# Altium schematic sheet Sheet1.SchDoc
size A4; SheetNumber: 1; SheetTotal: 1; SPICEModelCacheJLRNBVED: <root> / <DocumentId>JLRNBVED</DocumentId> / </root>
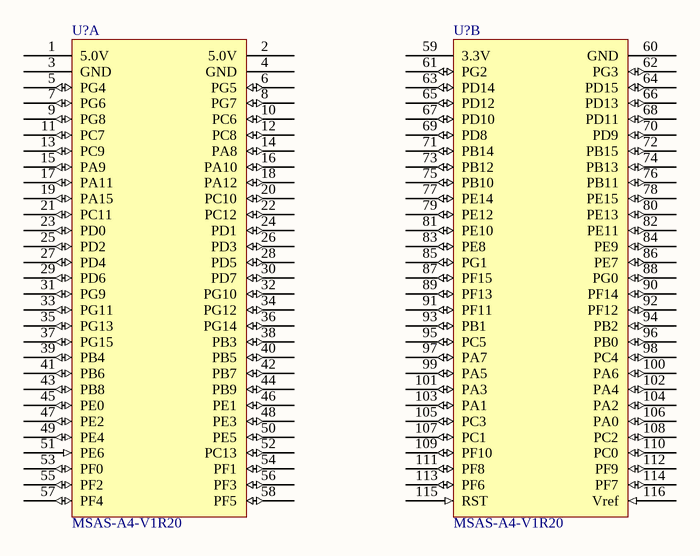
[diagram p0: Sheet1.SchDoc]

## Parts
(Parts that share a designator on the sheet are numbered #1, #2 ... from top to bottom, then left to right.)
U?#1  MSAS-A4-V1R20  [MSAS-A4-PCBLIB-V1R20]  (part A of 2)
U?#2  MSAS-A4-V1R20  [MSAS-A4-PCBLIB-V1R20]  (part B of 2)

## Nets

Not connected (* = marked no-connect by the designer): U?#1 1(5.0V) 2(5.0V) 3(GND) 4(GND) 5(PG4) 6(PG5) 7(PG6) 8(PG7) 9(PG8) 10(PC6) 11(PC7) 12(PC8) 13(PC9) 14(PA8) 15(PA9) 16(PA10) 17(PA11) 18(PA12) 19(PA15) 20(PC10) 21(PC11) 22(PC12) 23(PD0) 24(PD1) 25(PD2) 26(PD3) 27(PD4) 28(PD5) 29(PD6) 30(PD7) 31(PG9) 32(PG10) 33(PG11) 34(PG12) 35(PG13) 36(PG14) 37(PG15) 38(PB3) 39(PB4) 40(PB5) 41(PB6) 42(PB7) 43(PB8) 44(PB9) 45(PE0) 46(PE1) 47(PE2) 48(PE3) 49(PE4) 50(PE5) 51(PE6) 52(PC13) 53(PF0) 54(PF1) 55(PF2) 56(PF3) 57(PF4) 58(PF5); U?#2 59(3.3V) 60(GND) 61(PG2) 62(PG3) 63(PD14) 64(PD15) 65(PD12) 66(PD13) 67(PD10) 68(PD11) 69(PD8) 70(PD9) 71(PB14) 72(PB15) 73(PB12) 74(PB13) 75(PB10) 76(PB11) 77(PE14) 78(PE15) 79(PE12) 80(PE13) 81(PE10) 82(PE11) 83(PE8) 84(PE9) 85(PG1) 86(PE7) 87(PF15) 88(PG0) 89(PF13) 90(PF14) 91(PF11) 92(PF12) 93(PB1) 94(PB2) 95(PC5) 96(PB0) 97(PA7) 98(PC4) 99(PA5) 100(PA6) 101(PA3) 102(PA4) 103(PA1) 104(PA2) 105(PC3) 106(PA0) 107(PC1) 108(PC2) 109(PF10) 110(PC0) 111(PF8) 112(PF9) 113(PF6) 114(PF7) 115(RST) 116(Vref)

## Library data of the parts
U?#1 U?#2 = MSAS-A4-V1R20: MSAS-A4-V1R20:STM32F103ZET6